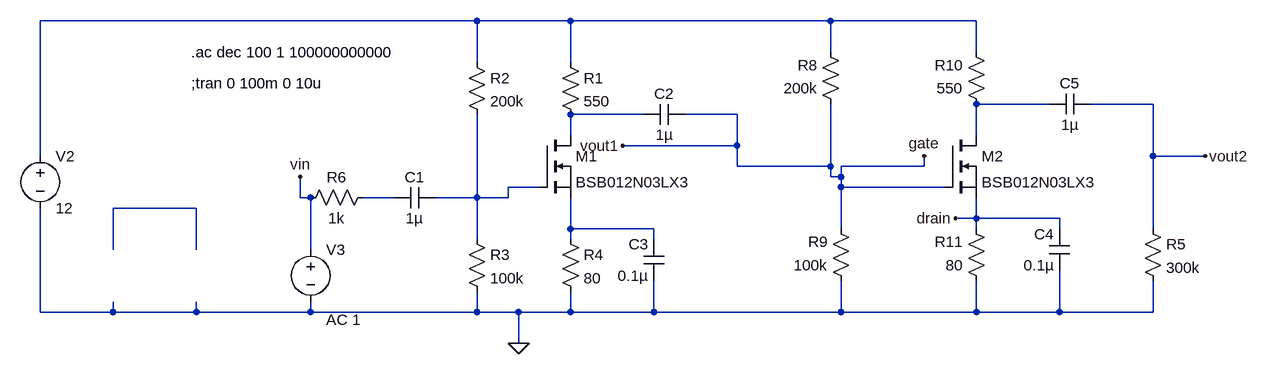
[diagram p0: schematic q4.asc]
q4.asc, the LTspice schematic file:
Version 4
SHEET 1 1700 680
WIRE 496 -160 -176 -160
WIRE 640 -160 496 -160
WIRE 1040 -160 640 -160
WIRE 1264 -160 1040 -160
WIRE 1040 -112 1040 -160
WIRE 1264 -112 1264 -160
WIRE 496 -96 496 -160
WIRE 640 -96 640 -160
WIRE 1376 -32 1264 -32
WIRE 1536 -32 1440 -32
WIRE 752 -16 640 -16
WIRE 896 -16 816 -16
WIRE 640 16 640 -16
WIRE 1264 16 1264 -32
WIRE 896 32 896 -16
WIRE 896 32 720 32
WIRE -176 48 -176 -160
WIRE 1536 48 1536 -32
WIRE 1616 48 1536 48
WIRE 896 64 896 32
WIRE 1040 64 1040 -32
WIRE 1040 64 896 64
WIRE 1184 64 1184 48
WIRE 1184 64 1056 64
WIRE 1040 80 1040 64
WIRE 1056 80 1056 64
WIRE 1056 80 1040 80
WIRE 592 96 544 96
WIRE 1056 96 1056 80
WIRE 1216 96 1056 96
WIRE 224 112 224 80
WIRE 240 112 224 112
WIRE 368 112 320 112
WIRE 496 112 496 -16
WIRE 496 112 432 112
WIRE 544 112 544 96
WIRE 544 112 496 112
WIRE 64 128 -64 128
WIRE 1264 144 1264 112
WIRE 1264 144 1232 144
WIRE 1392 144 1264 144
WIRE 640 160 640 112
WIRE 768 160 640 160
WIRE 1056 160 1056 96
WIRE 1264 160 1264 144
WIRE 1392 160 1392 144
WIRE 1536 160 1536 48
WIRE 496 176 496 112
WIRE 640 176 640 160
WIRE 768 176 768 160
WIRE -64 192 -64 128
WIRE 64 192 64 128
WIRE 240 192 240 112
WIRE -176 288 -176 128
WIRE -64 288 -64 272
WIRE -64 288 -176 288
WIRE 64 288 64 272
WIRE 64 288 -64 288
WIRE 240 288 240 272
WIRE 240 288 64 288
WIRE 496 288 496 256
WIRE 496 288 240 288
WIRE 560 288 496 288
WIRE 640 288 640 256
WIRE 640 288 560 288
WIRE 768 288 768 240
WIRE 768 288 640 288
WIRE 1056 288 1056 240
WIRE 1056 288 768 288
WIRE 1264 288 1264 240
WIRE 1264 288 1056 288
WIRE 1392 288 1392 224
WIRE 1392 288 1264 288
WIRE 1536 288 1536 240
WIRE 1536 288 1392 288
WIRE 560 336 560 288
FLAG 560 336 0
FLAG 224 80 vin
FLAG 1184 48 gate
FLAG 1232 144 drain
FLAG 1616 48 vout2
FLAG 720 32 vout1
SYMBOL voltage -176 32 R0
WINDOW 123 0 0 Left 0
WINDOW 39 0 0 Left 0
SYMATTR InstName V2
SYMATTR Value 12
SYMBOL voltage 240 176 R0
WINDOW 123 24 124 Left 2
WINDOW 39 0 0 Left 0
SYMATTR InstName V3
SYMATTR Value ""
SYMATTR Value2 AC 1
SYMBOL res 624 -112 R0
SYMATTR InstName R1
SYMATTR Value 550
SYMBOL res 480 -112 R0
SYMATTR InstName R2
SYMATTR Value 200k
SYMBOL res 480 160 R0
SYMATTR InstName R3
SYMATTR Value 100k
SYMBOL res 624 160 R0
SYMATTR InstName R4
SYMATTR Value 80
SYMBOL res 1520 144 R0
SYMATTR InstName R5
SYMATTR Value 300k
SYMBOL res 336 96 R90
WINDOW 0 0 56 VBottom 2
WINDOW 3 32 56 VTop 2
SYMATTR InstName R6
SYMATTR Value 1k
SYMBOL res 1056 -16 R180
WINDOW 0 36 76 Left 2
WINDOW 3 36 40 Left 2
SYMATTR InstName R8
SYMATTR Value 200k
SYMBOL res 1072 256 R180
WINDOW 0 36 76 Left 2
WINDOW 3 36 40 Left 2
SYMATTR InstName R9
SYMATTR Value 100k
SYMBOL res 1280 -16 R180
WINDOW 0 36 76 Left 2
WINDOW 3 36 40 Left 2
SYMATTR InstName R10
SYMATTR Value 550
SYMBOL res 1280 256 R180
WINDOW 0 36 76 Left 2
WINDOW 3 36 40 Left 2
SYMATTR InstName R11
SYMATTR Value 80
SYMBOL cap 432 96 R90
WINDOW 0 0 32 VBottom 2
WINDOW 3 32 32 VTop 2
SYMATTR InstName C1
SYMATTR Value 1µ
SYMBOL cap 816 -32 R90
WINDOW 0 0 32 VBottom 2
WINDOW 3 32 32 VTop 2
SYMATTR InstName C2
SYMATTR Value 1µ
SYMBOL cap 784 240 R180
WINDOW 0 24 56 Left 2
WINDOW 3 24 8 Left 2
SYMATTR InstName C3
SYMATTR Value 0.1µ
SYMBOL cap 1408 224 R180
WINDOW 0 24 56 Left 2
WINDOW 3 24 8 Left 2
SYMATTR InstName C4
SYMATTR Value 0.1µ
SYMBOL cap 1376 -16 R270
WINDOW 0 32 32 VTop 2
WINDOW 3 0 32 VBottom 2
SYMATTR InstName C5
SYMATTR Value 1µ
SYMBOL nmos 592 16 R0
SYMATTR InstName M1
SYMATTR Value BSB012N03LX3
SYMBOL nmos 1216 16 R0
SYMATTR InstName M2
SYMATTR Value BSB012N03LX3
TEXT 56 -64 Left 2 !;tran 0 100m 0 10u
TEXT 56 -112 Left 2 !.ac dec 100 1 100000000000

The netlist it stands for:
* q4.asc
V2 N001 0 12
V3 vin 0 AC 1
R1 N001 N003 550
R2 N001 N004 200k
R3 N004 0 100k
R4 N007 0 80
R5 vout2 0 300k
R6 N005 vin 1k
R8 vout1 N001 200k
R9 0 vout1 100k
R10 N002 N001 550
R11 0 drain 80
C1 N004 N005 1µ
C2 vout1 N003 1µ
C3 0 N007 0.1µ
C4 0 drain 0.1µ
C5 N002 vout2 1µ
M1 N003 N004 N007 N007 BSB012N03LX3
M2 N002 vout1 drain drain BSB012N03LX3
.model NMOS NMOS
.model PMOS PMOS
.lib standard.mos
;tran 0 100m 0 10u
.ac dec 100 1 100000000000
.backanno
.end